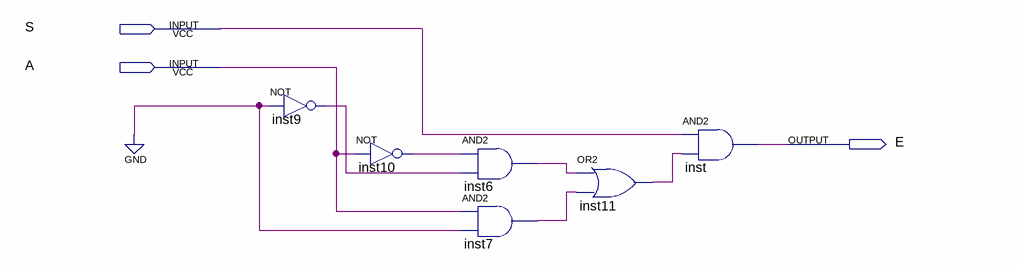
[diagram p0: schematic sheet]
// Quartus schematic IsZero.bdf as structural Verilog: 6 symbols, 3 pins
module IsZero (
  input  S,
  input  A,
  output E
);

  wire inst6_out, inst7_out, inst9_out, inst10_out, inst11_out;

  not inst9 (inst9_out, 1'b0);
  not inst10 (inst10_out, A);
  and inst6 (inst6_out, inst10_out, inst9_out);
  and inst7 (inst7_out, A, 1'b0);
  or inst11 (inst11_out, inst6_out, inst7_out);
  and inst (E, S, inst11_out);
endmodule
